# Altium schematic sheet 7_dc_dc_5v_radios.schdoc: Radios Step-Down Converters 5V/3A
size A4; DrawnBy: Sara V. Martínez; Engineer: Flight; DocumentNumber: 11; Revision: V0.1; SheetNumber: 11; SheetTotal: 11; Designed by: Andre M. P. Mattos
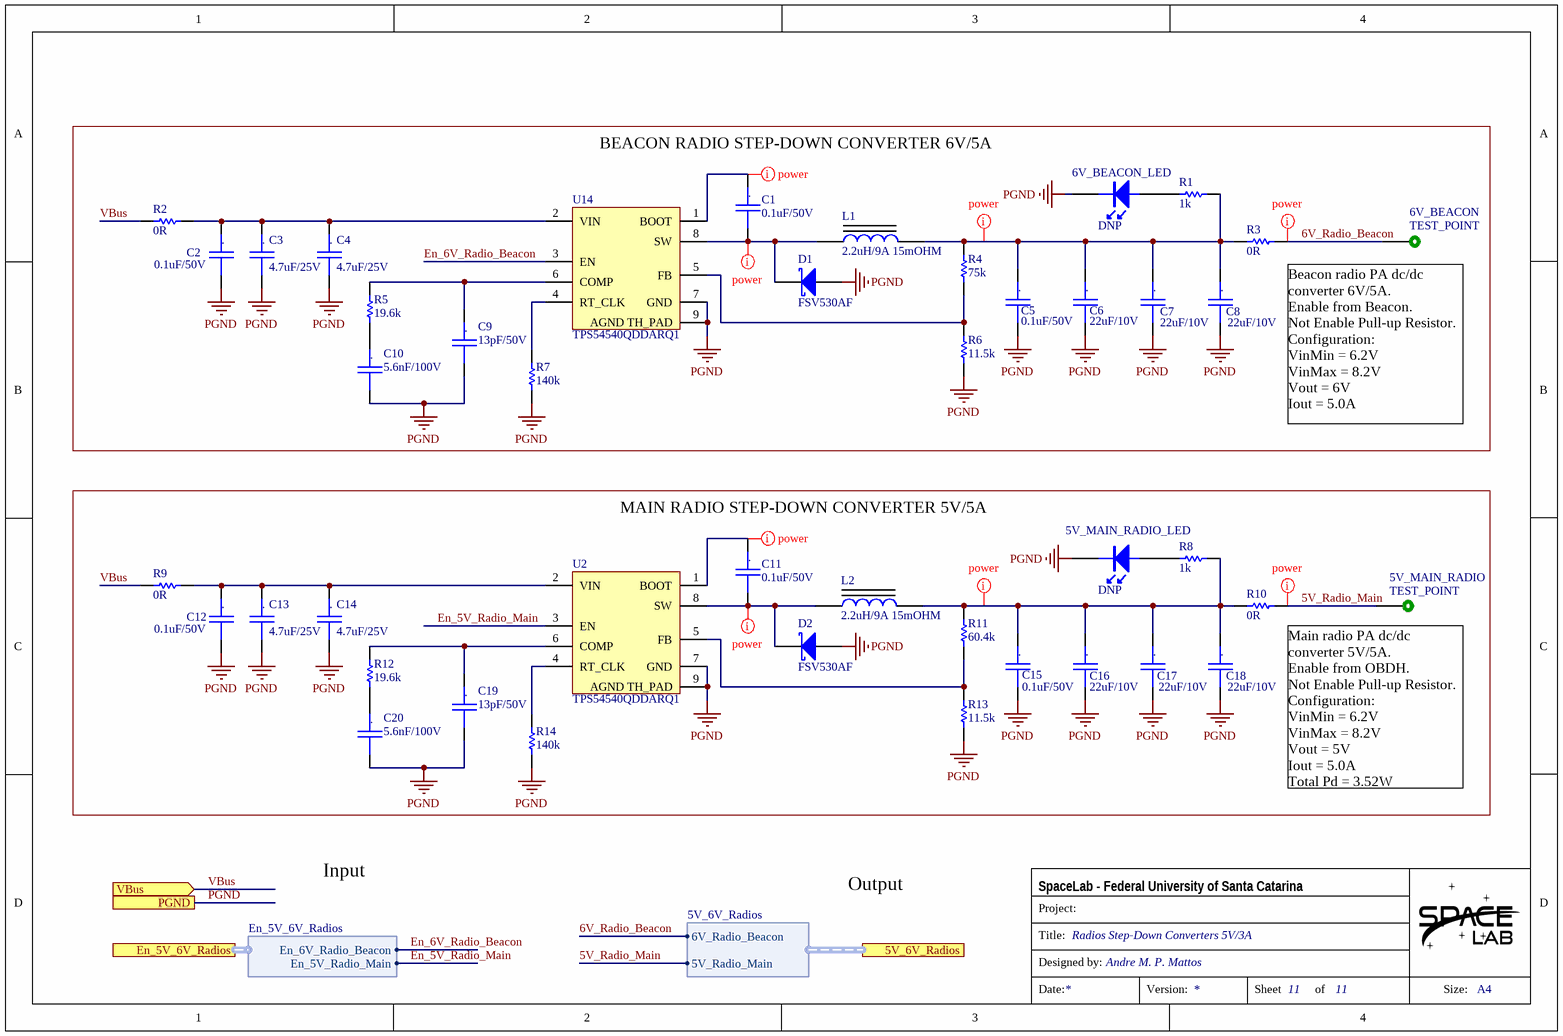
[diagram p0: 7_dc_dc_5v_radios.schdoc]

## Parts
5V_MAIN_RADIO  TEST_POINT  [TEST_POINT]  (no BOM)
5V_MAIN_RADIO_LED  DNP  [0603-LED]
6V_BEACON  TEST_POINT  [TEST_POINT]  (no BOM)
6V_BEACON_LED  DNP  [0603-LED]
C1  0.1uF/50V  [CC0805]
C2  0.1uF/50V  [CC0805]
C3  4.7uF/25V  [CC0805]
C4  4.7uF/25V  [CC0805]
C5  0.1uF/50V  [CC0805]
C6  22uF/10V  [CC1206]
C7  22uF/10V  [CC1206]
C8  22uF/10V  [CC1206]
C9  13pF/50V  [CC0603]
C10  5.6nF/100V  [CC0603]
C11  0.1uF/50V  [CC0805]
C12  0.1uF/50V  [CC0805]
C13  4.7uF/25V  [CC0805]
C14  4.7uF/25V  [CC0805]
C15  0.1uF/50V  [CC0805]
C16  22uF/10V  [CC1206]
C17  22uF/10V  [CC1206]
C18  22uF/10V  [CC1206]
C19  13pF/50V  [CC0603]
C20  5.6nF/100V  [CC0603]
D1  FSV530AF  [DO-214AC]
D2  FSV530AF  [DO-214AC]
L1  2.2uH/9A 15mOHM  [Ind_SRP6540]
L2  2.2uH/9A 15mOHM  [Ind_SRP6540]
R1  1k  [0603]
R2  0R  [1206]
R3  0R  [1206]
R4  75k  [0805]
R5  19.6k  [0603]
R6  11.5k  [0805]
R7  140k  [0603]
R8  1k  [0603]
R9  0R  [1206]
R10  0R  [1206]
R11  60.4k  [0805]
R12  19.6k  [0603]
R13  11.5k  [0805]
R14  140k  [0603]
U2  TPS54540QDDARQ1  [SO8 Power PAD]
U14  TPS54540QDDARQ1  [SO8 Power PAD]

## Blocks framed on the sheet
BEACON RADIO STEP-DOWN CONVERTER 6V/5A: 6V_BEACON 6V_BEACON_LED C1-C10 D1 L1 R1-R7 U14
MAIN RADIO STEP-DOWN CONVERTER 5V/5A: 5V_MAIN_RADIO 5V_MAIN_RADIO_LED C11-C20 D2 L2 R8-R14 U2

## Ports
5V_6V_Radios (harness 5V_6V_Radios), En_5V_6V_Radios (harness En_5V_6V_Radios), PGND, VBus (in)

## Harnesses
5V_6V_Radios: 6V_Radio_Beacon, 5V_Radio_Main
En_5V_6V_Radios: En_6V_Radio_Beacon, En_5V_Radio_Main

## Nets
PGND: 5V_MAIN_RADIO_LED.2(K) 6V_BEACON_LED.2(K) C2.2 C3.2 C4.2 C5.2 C6.2 C7.2 C8.2 C9.2 C10.2 C12.2 C13.2 C14.2 C15.2 C16.2 C17.2 C18.2 C19.2 C20.2 D1.2(A) D2.2(A) R6.1 R7.1 R13.1 R14.1 U2.7(GND) U2.9(AGND_TH_PAD) U14.7(GND) U14.9(AGND_TH_PAD) ; port PGND
5V_Radio_Main: 5V_MAIN_RADIO.1 R10.1 ; port 5V_6V_Radios.5V_Radio_Main
6V_Radio_Beacon: 6V_BEACON.1 R3.1 ; port 5V_6V_Radios.6V_Radio_Beacon
En_5V_Radio_Main: U2.3(EN) ; port En_5V_6V_Radios.En_5V_Radio_Main
En_6V_Radio_Beacon: U14.3(EN) ; port En_5V_6V_Radios.En_6V_Radio_Beacon
VBus: R2.2 R9.2 ; port VBus
Net5V_MAIN_RADIO_LED_1: 5V_MAIN_RADIO_LED.1(A) R8.2
Net6V_BEACON_LED_1: 6V_BEACON_LED.1(A) R1.2
NetC1_1: C1.1 U14.1(BOOT)
NetC1_2: C1.2 D1.1(K) L1.1 U14.8(SW)
NetC2_1: C2.1 C3.1 C4.1 R2.1 U14.2(VIN)
NetC5_1: C5.1 C6.1 C7.1 C8.1 L1.2 R1.1 R3.2 R4.2
NetC9_1: C9.1 R5.2 U14.6(COMP)
NetC10_1: C10.1 R5.1
NetC11_1: C11.1 U2.1(BOOT)
NetC11_2: C11.2 D2.1(K) L2.1 U2.8(SW)
NetC12_1: C12.1 C13.1 C14.1 R9.1 U2.2(VIN)
NetC15_1: C15.1 C16.1 C17.1 C18.1 L2.2 R8.1 R10.2 R11.2
NetC19_1: C19.1 R12.2 U2.6(COMP)
NetC20_1: C20.1 R12.1
NetR4_1: R4.1 R6.2 U14.5(FB)
NetR7_2: R7.2 U14.4(RT_CLK)
NetR11_1: R11.1 R13.2 U2.5(FB)
NetR14_2: R14.2 U2.4(RT_CLK)

## Layout directives
net class power: 5V_Radio_Main, 6V_Radio_Beacon, NetC1_1, NetC1_2, NetC5_1, NetC11_1, NetC11_2, NetC15_1

## Notes on the sheet
- Beacon radio PA dc/dc converter 6V/5A.
  Enable from Beacon.
  Not Enable Pull-up Resistor.
  Configuration:
  VinMin = 6.2V
  VinMax = 8.2V
  Vout = 6V
  Iout = 5.0A
  Total Pd = 3.52W
- Main radio PA dc/dc converter 5V/5A.
  Enable from OBDH.
  Not Enable Pull-up Resistor.
  Configuration:
  VinMin = 6.2V
  VinMax = 8.2V
  Vout = 5V
  Iout = 5.0A
  Total Pd = 3.52W
- Input
- Output
- Project:
- SpaceLab - Federal University of Santa Catarina
- Title:
- Designed by:
- Date:
- Version:
- Sheet
- of
- Size:
- A4
- (in symbol Cap_Cer_C0G_5.6nF_100V_0603) .
- (in symbol Cap_Cer_C0G_13pF_50V_0603) .
- (in symbol Cap_Cer_X7R_0.1uF_50V_0805) .
- (in symbol Cap_Cer_X7R_4.7uF_25V_0805) .
- (in symbol Cap_Cer_X7R_22uF_10V_1206) .

## Library data of the parts
5V_MAIN_RADIO 6V_BEACON = TEST_POINT: Test point
5V_MAIN_RADIO_LED 6V_BEACON_LED = LED/G_0603: SMD Green LED; Partnumber: 150060VS75000; Manufacturer: Wurth Electronics; Dominant Wavelength: 570nm; Forward Current: 30mA; Forward Voltage: 2V; Lens Style: Clear,Rectangular; Luminous Intensity: 40mcd; Test Current: 20mA; Viewing Angle: 140°; NCM: 8541.40.21; Case/Package: 0603; Case Code (Imperial): 0603; Case Code (Metric): 1608; Color: Green; ComponentLink1Description: https://katalog.we-online.de/led/datasheet/150060VS75000.pdf?src-supplier=Digi-Key; ComponentLink1URL: https://katalog.we-online.de/led/datasheet/150060VS75000.pdf?src-supplier=Digi-Key; Height: 0.7mm; Length: 1.6mm; Manufacturer Part Number: 150060VS75000; Max Operating Temperature: 85°C; Min Operating Temperature: -40°C; Mount: Surface Mount; Number of Pins: 2; Package Quantity: 1; Packaging: Tape and Reel; Pricing 1: 1=0.14, 10=0.138, 25=0.138, 50=0.129, 100=0.11, 250=0.11 (USD); Pricing 2: 1=0.14, 50=0.133, 100=0.114, 500=0.099 (USD); REACH SVHC: Unknown; Stock 1: 16336; Stock 2: 31910; Supplier 1: Mouser; Supplier 2: Digi-Key; Supplier Part Number 1: 710-150060VS75000; Supplier Part Number 2: 732-4980-1-ND; Wavelength: 570nm; Width: 0.8mm
C1 C2 C5 C11 C12 C15 = Cap_Cer_X7R_0.1uF_50V_0805: CAP CER 0.1UF 50V 10% X7R 0805; Partnumber: CC0805KRX7R9BB104; Manufacturer: Yageo; Capacitance: 100nF; Insulation Resistance: 100GR; Material: Ceramic; Case/Package: 0805; Case Code (Imperial): 0805; Case Code (Metric): 2012; ComponentLink1Description: http://www.yageo.com/documents/recent/UPY-GPHC_X7R_6.3V-to-50V_8.pdf?src-supplier=Avnet; ComponentLink1URL: http://www.yageo.com/documents/recent/UPY-GPHC_X7R_6.3V-to-50V_8.pdf?src-supplier=Avnet; ComponentLink2Description: http://www.farnell.com/datasheets/1489800.pdf?src-supplier=Element14; ComponentLink2URL: http://www.farnell.com/datasheets/1489800.pdf?src-supplier=Element14; ComponentLink3Description: http://www.yageo.com/documents/recent/UPY-GPHC_X7R_6.3V-to-50V_18.pdf?src-supplier=Digi-Key; ComponentLink3URL: http://www.yageo.com/documents/recent/UPY-GPHC_X7R_6.3V-to-50V_18.pdf?src-supplier=Digi-Key; ComponentLink4Description: http://www.farnell.com/datasheets/2167236.pdf?src-supplier=Element14; ComponentLink4URL: http://www.farnell.com/datasheets/2167236.pdf?src-supplier=Element14; ComponentLink5Description: http://www.yageo.com/documents/recent/UPY-GPHC_X7R_6.3V-to-50V_8.pdf?src-supplier=Avnet+Europe; ComponentLink5URL: http://www.yageo.com/documents/recent/UPY-GPHC_X7R_6.3V-to-50V_8.pdf?src-supplier=Avnet+Europe; ComponentLink6Description: http://www.produktinfo.conrad.com/datenblaetter/425000-449999/445210-da-01-en-KERKO_CHIP_0805_X7R_0_1uF_10Proz_50VG.pdf?src-supplier=Conrad; ComponentLink6URL: http://www.produktinfo.conrad.com/datenblaetter/425000-449999/445210-da-01-en-KERKO_CHIP_0805_X7R_0_1uF_10Proz_50VG.pdf?src-supplier=Conrad; Depth: 1.25mm; Dielectric: X7R; Halogen Free: Halogen Free; Height: 0.85mm; Lead Free: Lead Free; Length: 2mm; Manufacturer Part Number: CC0805KRX7R9BB104; Max Operating Temperature: 125°C; Min Operating Temperature: -55°C; Mount: Surface Mount; Number of Pins: 2; Package Quantity: 1; Packaging: Tape and Reel; Pricing 1: 1=0.12, 10=0.087, 100=0.028, 1000=0.023, 4000=0.018, 8000=0.017 (USD); Pricing 2: 1=0.12, 10=0.088, 50=0.05, 100=0.0414, 500=0.02906, 1000=0.02405 (USD); Radiation Hardening: No; REACH SVHC: No SVHC; Stock 1: 3904445; Stock 2: 544494; Supplier 1: Mouser; Supplier 2: Digi-Key; Supplier Part Number 1: 603-CC805KRX7R9BB104; Supplier Part Number 2: 311-1140-1-ND; Termination: SMD/SMT; Thickness: 0.033inch; Tolerance: 10%; Voltage: 50V; Voltage Rating: 50V; Width: 0.049inch
C3 C4 C13 C14 = Cap_Cer_X7R_4.7uF_25V_0805: CAP CER 4.7uF 25V 10% X7R 0805; Partnumber: CC0805KKX7R8BB475; Manufacturer: Yageo; NCM: 8532.24.10; Capacitance: 4.7uF; Case/Package: 0805; Case Code (Imperial): 0805; Case Code (Metric): 2012; ComponentLink1Description: http://www.mouser.com/ds/2/447/Yageo_UPY-GP_NP0_16V-to-50V_9-358835.pdf?src-supplier=Mouser; ComponentLink1URL: http://www.mouser.com/ds/2/447/Yageo_UPY-GP_NP0_16V-to-50V_9-358835.pdf?src-supplier=Mouser; ComponentLink2Description: http://www.yageo.com/documents/recent/UPY-GPHC_X7R_6.3V-to-50V_18.pdf?src-supplier=Digi-Key; ComponentLink2URL: http://www.yageo.com/documents/recent/UPY-GPHC_X7R_6.3V-to-50V_18.pdf?src-supplier=Digi-Key; Dielectric: X7R; Halogen Free: Halogen Free; Lead Free: Lead Free; Length: 0.079inch; Manufacturer Part Number: CC0805KKX7R8BB475; Max Operating Temperature: 125°C; Min Operating Temperature: -55°C; Mount: Surface Mount; Package Quantity: 3000; Packaging: Tape and Reel; Pricing 1: 1=0.43, 10=0.25, 100=0.139, 1000=0.126, 3000=0.089, 9000=0.086 (USD); Pricing 2: 1=0.47, 10=0.327, 50=0.2288, 100=0.1962, 500=0.14714, 1000=0.12425 (USD); Stock 1: 121; Stock 2: 672; Supplier 1: Mouser; Supplier 2: Digi-Key; Supplier Part Number 1: 603-CC805KKX7R8BB475; Supplier Part Number 2: 311-1885-1-ND; Termination: SMD/SMT; Thickness: 0.057inch; Tolerance: 10%; Voltage Rating (DC): 25V; Voltage Rating: 25V; Weight: 0.000194oz; Width: 0.049inch
C6-C8 C16-C18 = Cap_Cer_X7R_22uF_10V_1206: CAP CER 22uF 10V 10% X7R 1206; Partnumber: GRM31CR71A226KE15L; Manufacturer: Murata; Material: Ceramic; NCM: 8532.24.10; Capacitance: 22uF; Case/Package: 1206; Case Code (Imperial): 1206; Case Code (Metric): 3216; ComponentLink1Description: http://components.arrow.com/part/dataview/46868660S8337524N2606?src-supplier=Arrow; ComponentLink1URL: http://components.arrow.com/part/dataview/46868660S8337524N2606?src-supplier=Arrow; ComponentLink2Description: http://uk.rs-online.com/webdocs/1423/0900766b81423c84.pdf?src-supplier=RSComponents; ComponentLink2URL: http://uk.rs-online.com/webdocs/1423/0900766b81423c84.pdf?src-supplier=RSComponents; ComponentLink3Description: https://www.murata.com/~/media/webrenewal/support/library/catalog/products/capacitor/mlcc/c02e.ashx?la=en-us&src-supplier=Digi-Key; ComponentLink3URL: https://www.murata.com/~/media/webrenewal/support/library/catalog/products/capacitor/mlcc/c02e.ashx?la=en-us&src-supplier=Digi-Key; ComponentLink4Description: http://www.farnell.com/datasheets/2048963.pdf?src-supplier=Farnell; ComponentLink4URL: http://www.farnell.com/datasheets/2048963.pdf?src-supplier=Farnell; ComponentLink5Description: http://www.farnell.com/datasheets/2048963.pdf?src-supplier=Element14; ComponentLink5URL: http://www.farnell.com/datasheets/2048963.pdf?src-supplier=Element14; ComponentLink6Description: http://psearch.en.murata.com/capacitor/product/GRM31CR71A226KE15%23.pdf?src-supplier=Avnet; ComponentLink6URL: http://psearch.en.murata.com/capacitor/product/GRM31CR71A226KE15%23.pdf?src-supplier=Avnet; ComponentLink7Description: http://psearch.murata.com/capacitor/product/GRM31CR71A226KE15%23.pdf?src-supplier=Avnet; ComponentLink7URL: http://psearch.murata.com/capacitor/product/GRM31CR71A226KE15%23.pdf?src-supplier=Avnet; ComponentLink8Description: https://www.distrelec.biz/Web/Downloads/_t/ds/murata_MLCC_eng_tds.pdf?mime=application%2Fpdf&src-supplier=Distrelec; ComponentLink8URL: https://www.distrelec.biz/Web/Downloads/_t/ds/murata_MLCC_eng_tds.pdf?mime=application%2Fpdf&src-supplier=Distrelec; ComponentLink9Description: http://psearch.murata.com/capacitor/product/GRM31CR71A226KE15%23.pdf?src-supplier=Future+Electronics; ComponentLink9URL: http://psearch.murata.com/capacitor/product/GRM31CR71A226KE15%23.pdf?src-supplier=Future+Electronics; ComponentLink10Description: http://www.produktinfo.conrad.com/datenblaetter/450000-474999/451412-da-01-de-VS_KONDENS_GRM31_CR71A_226KE15L.pdf?src-supplier=Conrad; ComponentLink10URL: http://www.produktinfo.conrad.com/datenblaetter/450000-474999/451412-da-01-de-VS_KONDENS_GRM31_CR71A_226KE15L.pdf?src-supplier=Conrad; ComponentLink11Description: http://www.produktinfo.conrad.com/datenblaetter/450000-474999/451120-da-01-de-VS_CHIP_KOND_1206_22_0_UF_10Pr_10_0V_X7R.pdf?src-supplier=Conrad; ComponentLink11URL: http://www.produktinfo.conrad.com/datenblaetter/450000-474999/451120-da-01-de-VS_CHIP_KOND_1206_22_0_UF_10Pr_10_0V_X7R.pdf?src-supplier=Conrad; Depth: 1.6mm; Dielectric: X7R; Height: 1.6mm; Lead Free: Lead Free; Length: 3.2mm; Manufacturer Part Number: GRM31CR71A226KE15L; Max Operating Temperature: 125°C; Min Operating Temperature: -55°C; Mount: Surface Mount; Package Quantity: 1; Packaging: Tape and Reel; Pricing 1: 1=1.11, 10=0.921, 100=0.697, 250=0.677, 500=0.527, 1000=0.464 (USD); Pricing 2: 1=1.13, 10=0.889, 50=0.7702, 100=0.6666, 500=0.50362, 1000=0.44438 (USD); Radiation Hardening: No; REACH SVHC: No SVHC; Stock 1: 113879; Stock 2: 339340; Supplier 1: Mouser; Supplier 2: Digi-Key; Supplier Part Number 1: 81-GRM31CR71A226K15L; Supplier Part Number 2: 490-5309-1-ND; Termination: SMD/SMT; Thickness: 0.071inch; Tolerance: 10%; Voltage: 10V; Voltage Rating (DC): 10V; Voltage Rating: 10V; Width: 0.063inch
C9 C19 = Cap_Cer_C0G_13pF_50V_0603: CAP CER 13PF 50V 0603 NP0; Partnumber: C0603C130J5GAC7867; Manufacturer: KEMET; Manufacturer Part Number: C0603C130J5GACTU; Dielectric: C0G; Dielectric Material: Ceramic; Dissipation Factor: 0.1%; Tolerance: 5%; NCM: 8532.24.10; Capacitance: 13pF; Case/Package: 0603; Case Code (Imperial): 0603; Case Code (Metric): 1608; ComponentLink1Description: http://www.farnell.com/datasheets/2740893.pdf?src-supplier=Element14; ComponentLink1URL: http://www.farnell.com/datasheets/2740893.pdf?src-supplier=Element14; ComponentLink2Description: http://www.mouser.com/ds/2/212/KEM_C1003_C0G_SMD-1101588.pdf?src-supplier=Mouser; ComponentLink2URL: http://www.mouser.com/ds/2/212/KEM_C1003_C0G_SMD-1101588.pdf?src-supplier=Mouser; Depth: 0.8mm; Height: 0.8mm; Lead Free: Lead Free; Lead Pitch: 0.7mm; Length: 1.6mm; Max Operating Temperature: 125°C; Min Operating Temperature: -55°C; Mount: Surface Mount; Number of Pins: 2; Package Quantity: 4000; Packaging: Tape and Reel; Pricing 1: 1=0.2, 10=0.081, 100=0.056, 500=0.044, 1000=0.038, 4000=0.031 (USD); Pricing 2: 1=0.2, 10=0.134, 100=0.0678, 500=0.04638, 1000=0.04104 (USD); Radiation Hardening: No; REACH SVHC: No SVHC; Stock 1: 7365; Stock 2: 14291; Supplier 1: Mouser; Supplier 2: Digi-Key; Supplier Part Number 1: 80-C0603C130J5G; Supplier Part Number 2: 399-15362-1-ND; Termination: SMD/SMT; Thickness: 0.034inch; Voltage Rating (DC): 50V; Voltage Rating: 50V; Width: 0.031inch
C10 C20 = Cap_Cer_C0G_5.6nF_100V_0603: CAP CER 5.6nF 100V 0603; Partnumber: C1608C0G2A562J080AE; Manufacturer: TDK; NCM: 8532.24.10; ComponentLink1Description: https://product.tdk.com/info/en/catalog/datasheets/mlcc_commercial_soft_en.pdf?src-supplier=Digi-Key; ComponentLink1URL: https://product.tdk.com/info/en/catalog/datasheets/mlcc_commercial_soft_en.pdf?src-supplier=Digi-Key; Manufacturer Part Number: C1608C0G2A562J080AE; Pricing 1: 1=0.3, 10=0.142, 100=0.095, 500=0.084, 1000=0.078, 4000=0.056 (USD); Pricing 2: 1=0.32, 10=0.218, 50=0.1456, 100=0.1237, 500=0.08732, 1000=0.0764 (USD); Stock 1: 5883; Stock 2: 7070; Supplier 1: Mouser; Supplier 2: Digi-Key; Supplier Part Number 1: 810-C1608C0G2A562J08; Supplier Part Number 2: 445-180278-1-ND
D1 D2 = DIODE_SCHOTTKY_30V_5A_RB080L-30TE25: DIODE SCHOTTKY 30V 5A DO-214AA; Manufacturer: ON Semiconductor / Fairchild; Element Configuration: Single; Max Forward Surge Current (Ifsm): 100A; Reverse Recovery Time: 15.72ns; NCM: 8541.10.29; Partnumber: FSV530AF; Average Rectified Current: 5A; ComponentLink1Description: https://www.fairchildsemi.com/datasheets/FS/FSV530AF.pdf?src-supplier=Digi-Key; ComponentLink1URL: https://www.fairchildsemi.com/datasheets/FS/FSV530AF.pdf?src-supplier=Digi-Key; ComponentLink2Description: http://www.farnell.com/datasheets/2552640.pdf?src-supplier=Farnell; ComponentLink2URL: http://www.farnell.com/datasheets/2552640.pdf?src-supplier=Farnell; ComponentLink3Description: http://www.farnell.com/datasheets/2552640.pdf?src-supplier=Element14; ComponentLink3URL: http://www.farnell.com/datasheets/2552640.pdf?src-supplier=Element14; Lead Free: Lead Free; Manufacturer Part Number: FSV530AF; Max Repetitive Reverse Voltage (Vrrm): 30V; Max Reverse Voltage (DC): 30V; Mount: Surface Mount; Packaging: Cut Tape; Pricing 1: 1=0.47, 10=0.348, 100=0.202, 1000=0.137, 2500=0.121, 10000=0.117 (USD); Pricing 2: 1=0.47, 10=0.381, 25=0.3484, 100=0.2187, 250=0.21628, 500=0.2025, 1000=0.1377, 2500=0.13203, 5000=0.1215 (USD); Stock 1: 19843; Stock 2: 9965; Supplier 1: Mouser; Supplier 2: Digi-Key; Supplier Part Number 1: 512-FSV530AF; Supplier Part Number 2: FSV530AFCT-ND; Weight: 0.33g
L1 L2 = IND_POWER_2.2uH_9A_15mR: INDUCTOR 2.2UH 9A SMD; Partnumber: SRP6540-2R2M; Manufacturer: Bourns; Core Material: Ferrite; DC Resistance (DCR): 15.5mR; Inductance Tolerance: 20%; Self Resonant Frequency: 100kHz; Shielding: Shielded; NCM: 8504.50.00; Case/Package: 2826; ComponentLink1Description: http://www.bourns.com/docs/Product-Datasheets/SRP6540.pdf?src-supplier=Digi-Key; ComponentLink1URL: http://www.bourns.com/docs/Product-Datasheets/SRP6540.pdf?src-supplier=Digi-Key; ComponentLink2Description: https://www.bourns.com/docs/Product-Datasheets/SRP6540.pdf?src-supplier=Digi-Key; ComponentLink2URL: https://www.bourns.com/docs/Product-Datasheets/SRP6540.pdf?src-supplier=Digi-Key; ComponentLink3Description: http://www.farnell.com/datasheets/1698468.pdf?src-supplier=Element14; ComponentLink3URL: http://www.farnell.com/datasheets/1698468.pdf?src-supplier=Element14; Composition: Wirewound; Current Rating: 9A; Depth: 6.7mm; Height - Seated (Max): 0.157inch; Height: 4mm; Inductance: 2.2uH; Length: 7.2mm; Manufacturer Part Number: SRP6540-2R2M; Material: Ferrite; Max DC Current: 9A; Max Operating Temperature: 125°C; Military Standard: Not; Min Operating Temperature: -55°C; Mount: Surface Mount; Package Quantity: 1200; Packaging: Tape and Reel; Pricing 1: 1=1.2, 10=1.14, 50=0.953, 100=0.878, 250=0.801, 500=0.672 (USD); Pricing 2: 1=1.42, 10=1.323, 25=1.2212, 50=1.0176, 100=0.9565, 250=0.85472, 500=0.7326 (USD); REACH SVHC: No SVHC; RMS Current (Irms): 9A; Saturation Current: 9A; Stock 1: 1265; Stock 2: 3610; Supplier 1: Mouser; Supplier 2: Digi-Key; Supplier Part Number 1: 652-SRP6540-2R2M; Supplier Part Number 2: SRP6540-2R2MCT-ND; Termination: SMD/SMT; Test Frequency: 100kHz; Tolerance: 20%; Width: 6.5mm
R1 R8 = R1.0k_1%_1/8W_0603: RES 1.0K OHM 1/8W 1% 0603; Partnumber: MCT06030C1001FP500; Manufacturer: Vishay; Max Power Dissipation: 125mW; Power Rating: 100mW; Resistance: 1kR; Temperature Coefficient: 50ppm/°C; Voltage Rating (DC): 75V; NCM: 8533.21.20; Case/Package: 0603; Case Code (Imperial): 0603; Case Code (Metric): 1608; ComponentLink1Description: http://www.vishay.com/docs/28705/mcx0x0xpro.pdf?src-supplier=Digi-Key; ComponentLink1URL: http://www.vishay.com/docs/28705/mcx0x0xpro.pdf?src-supplier=Digi-Key; ComponentLink2Description: http://www.vishay.com/docs/28705/mc_pro.pdf?src-supplier=Avnet+Europe; ComponentLink2URL: http://www.vishay.com/docs/28705/mc_pro.pdf?src-supplier=Avnet+Europe; ComponentLink3Description: http://www.vishay.com/docs/28705/mc_pro.pdf?src-supplier=Avnet; ComponentLink3URL: http://www.vishay.com/docs/28705/mc_pro.pdf?src-supplier=Avnet; ComponentLink4Description: http://www.vishay.com/docs/28705/mc_pro.pdf?src-supplier=Future+Electronics; ComponentLink4URL: http://www.vishay.com/docs/28705/mc_pro.pdf?src-supplier=Future+Electronics; Composition: Thin Film; Contact Plating: Tin; Depth: 0.85mm; Height: 0.022inch; Lead Free: Lead Free; Length: 1.55mm; Manufacturer Part Number: MCT06030C1001FP500; Max Operating Temperature: 125°C; Military Standard: Not; Min Operating Temperature: -55°C; Mount: Surface Mount; Number of Terminations: 2; Package Quantity: 1; Packaging: Tape and Reel; Pricing 1: 1=0.1, 1000=0.025, 2000=0.023, 5000=0.019, 10000=0.018, 20000=0.017 (USD); Pricing 2: 1=0.17, 10=0.145, 100=0.0568, 1000=0.02376, 2500=0.02178 (USD); Radiation Hardening: No; REACH SVHC: Unknown; Stock 1: 142157; Stock 2: 268907; Supplier 1: Mouser; Supplier 2: Digi-Key; Supplier Part Number 1: 594-MCT06030C1001FP5; Supplier Part Number 2: MCT0603-1.00K-CFCT-ND; Termination: SMD/SMT; Tolerance: 1%; Voltage Rating: 75V; Weight: 7.1E-05oz; Width: 0.033inch
R2 R3 R9 R10 = R0R_JUMPER_3/4W_1206: RES 0.0 OHM 3/4W JUMP 1206; Partnumber: HCJ1206ZT0R00; Manufacturer: Stackpole Electronics; Resistance: 0mR; Fitted: No (jumper resistor); Case/Package: 1206; Case Code (Imperial): 1206; Case Code (Metric): 3216; ComponentLink1Description: http://www.seielect.com/Catalog/SEI-HCJ.pdf?src-supplier=Avnet; ComponentLink1URL: http://www.seielect.com/Catalog/SEI-HCJ.pdf?src-supplier=Avnet; ComponentLink2Description: https://www.seielect.com/Catalog/SEI-HCJ.pdf?src-supplier=Avnet+Asia; ComponentLink2URL: https://www.seielect.com/Catalog/SEI-HCJ.pdf?src-supplier=Avnet+Asia; ComponentLink3Description: https://www.seielect.com/catalog/SEI-HCJ.pdf?src-supplier=Digi-Key; ComponentLink3URL: https://www.seielect.com/catalog/SEI-HCJ.pdf?src-supplier=Digi-Key; ComponentLink4Description: https://www.seielect.com/catalog/SEI-Packaging.pdf?src-supplier=Digi-Key; ComponentLink4URL: https://www.seielect.com/catalog/SEI-Packaging.pdf?src-supplier=Digi-Key; Features: Automotive AEC-Q200; Height: 0.026inch; Length: 0.122inch; Manufacturer Part Number: HCJ1206ZT0R00; Max Operating Temperature: 155°C; Min Operating Temperature: -55°C; Mount: Surface Mount; Number of Terminations: 2; Package Quantity: 5000; Packaging: Tape and Reel; Pricing 1: 1=0.5, 10=0.358, 25=0.2788, 50=0.236, 100=0.1859, 250=0.15732, 500=0.1287, 1000=0.1001 (USD); Radiation Hardening: No; Stock 1: 1958428; Supplier 1: Digi-Key; Supplier Part Number 1: HCJ1206ZT0R00CT-ND; Termination: Wraparound; Width: 0.061inch
R4 = R75k_1%_1/8W_0805_1: RES 75k OHM 1/8W 1% 0805; Partnumber: RMCF0805FT75K0; Manufacturer: Panasonic; Voltage Rating: 150V; Resistance: 75kR; Power Rating: 125mW; Temperature Coefficient: 100ppm/°C; NCM: 8533.21.20; Stock 1: 48520; Pricing 1: 1=0.1, 10=0.072, 100=0.028, 1000=0.02, 5000=0.018, 10000=0.016 (USD); Mount: Surface Mount; Case/Package: 0805; Case Code (Metric): 2012; Case Code (Imperial): 0805; Contact Plating: Tin; Min Operating Temperature: -55°C; Max Operating Temperature: 155°C; Packaging: Tape and Reel; Tolerance: 1%; Package Quantity: 1; Composition: Thick Film; Number of Terminations: 2; Termination: SMD/SMT; Military Standard: Not; Max Power Dissipation: 125mW; Voltage Rating (DC): 150V; Features: Automotive AEC-Q200; Length: 2mm; Height: 0.028inch; Width: 0.049inch; Depth: 1.25mm; Height - Seated (Max): 0.028inch; Radiation Hardening: No; REACH SVHC: No SVHC; Lead Free: Lead Free; Supplier 2: Digi-Key; Stock 2: 93748; Pricing 2: 1=0.1, 10=0.072, 100=0.0275, 1000=0.0121, 2500=0.01045 (USD); Manufacturer Part Number: RMCF0805FT75K0; ComponentLink1Description: Digikey; ComponentLink1URL: https://www.digikey.com/product-detail/en/stackpole-electronics-inc/RMCF0805FT75K0/RMCF0805FT75K0CT-ND/1942483; Supplier Part Number 2: RMCF0805FT75K0CT-ND
R5 R12 = R19.6k_1%_1/10W_0603: RES 19.6k OHM 1/10W 1% 0603; Partnumber: ERJ-3EKF1962V; Manufacturer: Panasonic; Power Rating: 100mW; Resistance: 19.6kR; Temperature Coefficient: 100ppm/°C; Voltage Rating (DC): 50V; Voltage Rating: 75V; NCM: 8533.21.20; Case/Package: Molded; Case Code (Imperial): 0603; Case Code (Metric): 1608; ComponentLink1Description: http://www.farnell.com/datasheets/1911175.pdf?src-supplier=Farnell; ComponentLink1URL: http://www.farnell.com/datasheets/1911175.pdf?src-supplier=Farnell; Composition: Thick Film; Contact Plating: Tin; Depth: 0.8mm; Lead Free: Lead Free; Length: 1.6mm; Manufacturer Part Number: ERJ-3EKF1962V; Max Operating Temperature: 155°C; Military Standard: Not; Min Operating Temperature: -55°C; Mount: Surface Mount; Packaging: Cut Tape; Pricing 1: 1=0.1, 10=0.057, 100=0.023, 1000=0.009, 5000=0.006, 10000=0.005 (USD); Pricing 2: 1=0.1, 10=0.057, 100=0.0234, 1000=0.01049, 2500=0.00911 (USD); REACH SVHC: No SVHC; Stock 1: 90673; Stock 2: 62362; Supplier 1: Mouser; Supplier 2: Digi-Key; Supplier Part Number 1: 667-ERJ-3EKF1962V; Supplier Part Number 2: P19.6KHCT-ND; Tolerance: 1%; Width: 800um
R6 R13 = R11.5k_1%_1/8W_0805: RES 11.5k OHM 1/8W 1% 0805; Partnumber: AC0805FR-0711K5L; Manufacturer: Yageo; Resistance: 11.5kR; NCM: 8533.21.20; Case/Package: 0805; Manufacturer Part Number: AC0805FR-0711K5L; Pricing 1: 1=0.16, 10=0.037, 100=0.013, 1000=0.01, 5000=0.006, 10000=0.006 (USD); Stock 1: 26753; Supplier 1: Mouser; Supplier Part Number 1: 603-AC0805FR-0711K5L; Tolerance: 1%
R7 R14 = R140k_1%_1/5W_0603: RES 140k OHM 1/5W 1% 0603; Partnumber: ERJ-P03F1403V; Manufacturer: Panasonic; Power Rating: 200mW; Resistance: 140kR; Temperature Coefficient: 200ppm/°C; Voltage Rating (DC): 150V; NCM: 8533.21.20; Case/Package: 0603; Case Code (Imperial): 0603; Case Code (Metric): 1608; ComponentLink1Description: http://www.farnell.com/datasheets/2059624.pdf?src-supplier=Farnell; ComponentLink1URL: http://www.farnell.com/datasheets/2059624.pdf?src-supplier=Farnell; ComponentLink2Description: http://www.farnell.com/datasheets/1801181.pdf?src-supplier=Element14; ComponentLink2URL: http://www.farnell.com/datasheets/1801181.pdf?src-supplier=Element14; ComponentLink3Description: https://www.distrelec.biz/Web/Downloads/_t/ds/ERJP-series_eng_tds.pdf?mime=application%2Fpdf&src-supplier=Distrelec; ComponentLink3URL: https://www.distrelec.biz/Web/Downloads/_t/ds/ERJP-series_eng_tds.pdf?mime=application%2Fpdf&src-supplier=Distrelec; Composition: Thick Film; Height: 0.45mm; Length: 1.6mm; Manufacturer Part Number: ERJ-P03F1403V; Max Operating Temperature: 155°C; Min Operating Temperature: -55°C; Mount: Surface Mount; Package Quantity: 5000; Packaging: Tape and Reel; Pricing 1: 1=0.58, 10=0.231, 100=0.098, 1000=0.071, 5000=0.04, 10000=0.04 (USD); Pricing 2: 5000=0.03863 (USD); REACH SVHC: No SVHC; Stock 1: 4562; Stock 2: 0; Supplier 1: Mouser; Supplier 2: Digi-Key; Supplier Part Number 1: 667-ERJ-P03F1403V; Supplier Part Number 2: ERJ-P03F1403V-ND; Termination: SMD/SMT; Tolerance: 1%; Voltage Rating: 150V; Weight: 7.1E-05oz; Width: 0.8mm
R11 = R60.4k_1%_1/8W_0805: RES 60.4k OHM 1/8W 1% 0805; Partnumber: ERJ-6ENF6042V; Manufacturer: Panasonic; Max Power Dissipation: 125mW; Resistance: 60.4kR; Temperature Coefficient: 100ppm/°C; Voltage Rating (DC): 150V; NCM: 8533.21.20; Case/Package: 0805; Case Code (Imperial): 0805; Case Code (Metric): 2012; ComponentLink1Description: http://www.farnell.com/datasheets/426256.pdf?src-supplier=Farnell; ComponentLink1URL: http://www.farnell.com/datasheets/426256.pdf?src-supplier=Farnell; ComponentLink2Description: http://www.farnell.com/datasheets/426256.pdf?src-supplier=Element14; ComponentLink2URL: http://www.farnell.com/datasheets/426256.pdf?src-supplier=Element14; ComponentLink3Description: http://www.farnell.com/datasheets/1678782.pdf?src-supplier=Element14; ComponentLink3URL: http://www.farnell.com/datasheets/1678782.pdf?src-supplier=Element14; ComponentLink4Description: http://industrial.panasonic.com/www-data/pdf/AOA0000/AOA0000CE2.pdf?src-supplier=Avnet; ComponentLink4URL: http://industrial.panasonic.com/www-data/pdf/AOA0000/AOA0000CE2.pdf?src-supplier=Avnet; ComponentLink5Description: https://www.alliedelec.com/m/d/623f45ff1957d936ff56d46fd1c28cac.pdf?src-supplier=Allied+Electronics; ComponentLink5URL: https://www.alliedelec.com/m/d/623f45ff1957d936ff56d46fd1c28cac.pdf?src-supplier=Allied+Electronics; Composition: Thick Film; Contact Plating: Tin; Depth: 1.25mm; Features: Automotive AEC-Q200; Height - Seated (Max): 0.028inch; Height: 0.028inch; Lead Free: Lead Free; Length: 2mm; Manufacturer Part Number: ERJ-6ENF6042V; Max Operating Temperature: 155°C; Military Standard: Not; Min Operating Temperature: -55°C; Mount: Surface Mount; Number of Terminations: 2; Package Quantity: 1; Packaging: Tape and Reel; Power Rating: 125mW; Pricing 1: 1=0.1, 10=0.072, 100=0.028, 1000=0.02, 5000=0.018, 10000=0.016 (USD); Pricing 2: 1=0.1, 10=0.072, 100=0.0275, 1000=0.0121, 2500=0.01045 (USD); Radiation Hardening: No; REACH SVHC: No SVHC; Stock 1: 48520; Stock 2: 93748; Supplier 1: Mouser; Supplier 2: Digi-Key; Supplier Part Number 1: 667-ERJ-6ENF6042V; Supplier Part Number 2: P60.4KCCT-ND; Termination: SMD/SMT; Tolerance: 1%; Voltage Rating: 150V; Width: 0.049inch
U2 U14 = TPS54540QDDARQ1: Manufacturer: Texas Instruments; Max Input Voltage: 42V; Max Output Current: 5A; Max Output Voltage: 41.1V; Min Input Voltage: 4.5V; Min Output Voltage: 800mV; Number of Outputs: 1; Output Configuration: Positive; Output Type: Adjustable; Quiescent Current: 146uA; Switching Frequency: 2.5MHz; Synchronous Rectifier: No; Partnumber: TPS54540QDDARQ1; Case/Package: SOP; ComponentLink1Description: http://www.ti.com/lit/ds/symlink/tps54540-q1.pdf?src-supplier=Digi-Key; ComponentLink1URL: http://www.ti.com/lit/ds/symlink/tps54540-q1.pdf?src-supplier=Digi-Key; ComponentLink2Description: http://www.ti.com/lit/ds/symlink/tps54540-q1.pdf?src-supplier=Avnet; ComponentLink2URL: http://www.ti.com/lit/ds/symlink/tps54540-q1.pdf?src-supplier=Avnet; Contact Plating: Gold,Silver; Lead Free: Lead Free; Manufacturer Part Number: TPS54540QDDARQ1; Max Operating Temperature: 125°C; Min Operating Temperature: -40°C; Mount: Surface Mount; Number of Pins: 8; Operating Supply Voltage: 42V; Output Current: 5A; Output Voltage: 41.1V; Package Quantity: 2500; Packaging: Tape and Reel; Pricing 1: 1=5.69, 10=5.1, 25=4.83, 100=3.97, 250=3.56, 500=3.43 (USD); Pricing 2: 1=5.68, 10=5.1, 25=4.8216, 100=3.9646, 250=3.5574, 500=3.4288, 1000=2.85019 (USD); Radiation Hardening: No; Stock 1: 2115; Stock 2: 3151; Supplier 1: Mouser; Supplier 2: Digi-Key; Supplier Part Number 1: 595-TPS54540QDDARQ1; Supplier Part Number 2: 296-38301-1-ND; Weight: 0.000917oz